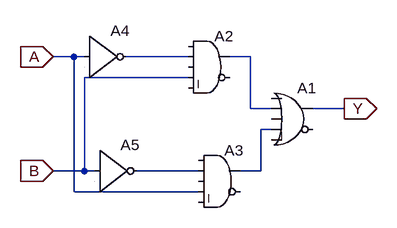
[diagram p0: schematic Draft4.asc]
Draft4.asc, the LTspice schematic file:
Version 4.1
SHEET 1 880 680
WIRE -48 64 -80 64
WIRE -32 64 -48 64
WIRE 128 64 32 64
WIRE 224 64 192 64
WIRE 128 96 -32 96
WIRE 224 144 224 64
WIRE 256 144 224 144
WIRE 368 144 320 144
WIRE 256 176 240 176
WIRE -32 240 -32 96
WIRE -32 240 -80 240
WIRE -16 240 -32 240
WIRE 144 240 48 240
WIRE 240 240 240 176
WIRE 240 240 208 240
WIRE -48 272 -48 64
WIRE 144 272 -48 272
FLAG -80 64 A
IOPIN -80 64 In
FLAG -80 240 B
IOPIN -80 240 In
FLAG 368 144 Y
IOPIN 368 144 Out
SYMBOL Digital\\or 288 96 R0
SYMATTR InstName A1
SYMBOL Digital\\and 160 16 R0
SYMATTR InstName A2
SYMBOL Digital\\and 176 192 R0
SYMATTR InstName A3
SYMBOL Digital\\inv -32 0 R0
SYMATTR InstName A4
SYMBOL Digital\\inv -16 176 R0
SYMATTR InstName A5

The netlist it stands for:
* Draft4.asc
A1 0 N002 0 N003 0 0 Y 0 OR
A2 0 N001 0 B 0 0 N002 0 AND
A3 0 N004 0 A 0 0 N003 0 AND
A4 A 0 0 0 0 N001 0 0 BUF
A5 B 0 0 0 0 N004 0 0 BUF
.backanno
.end